# Altium schematic sheet PV_Shutdown.SchDoc
size A
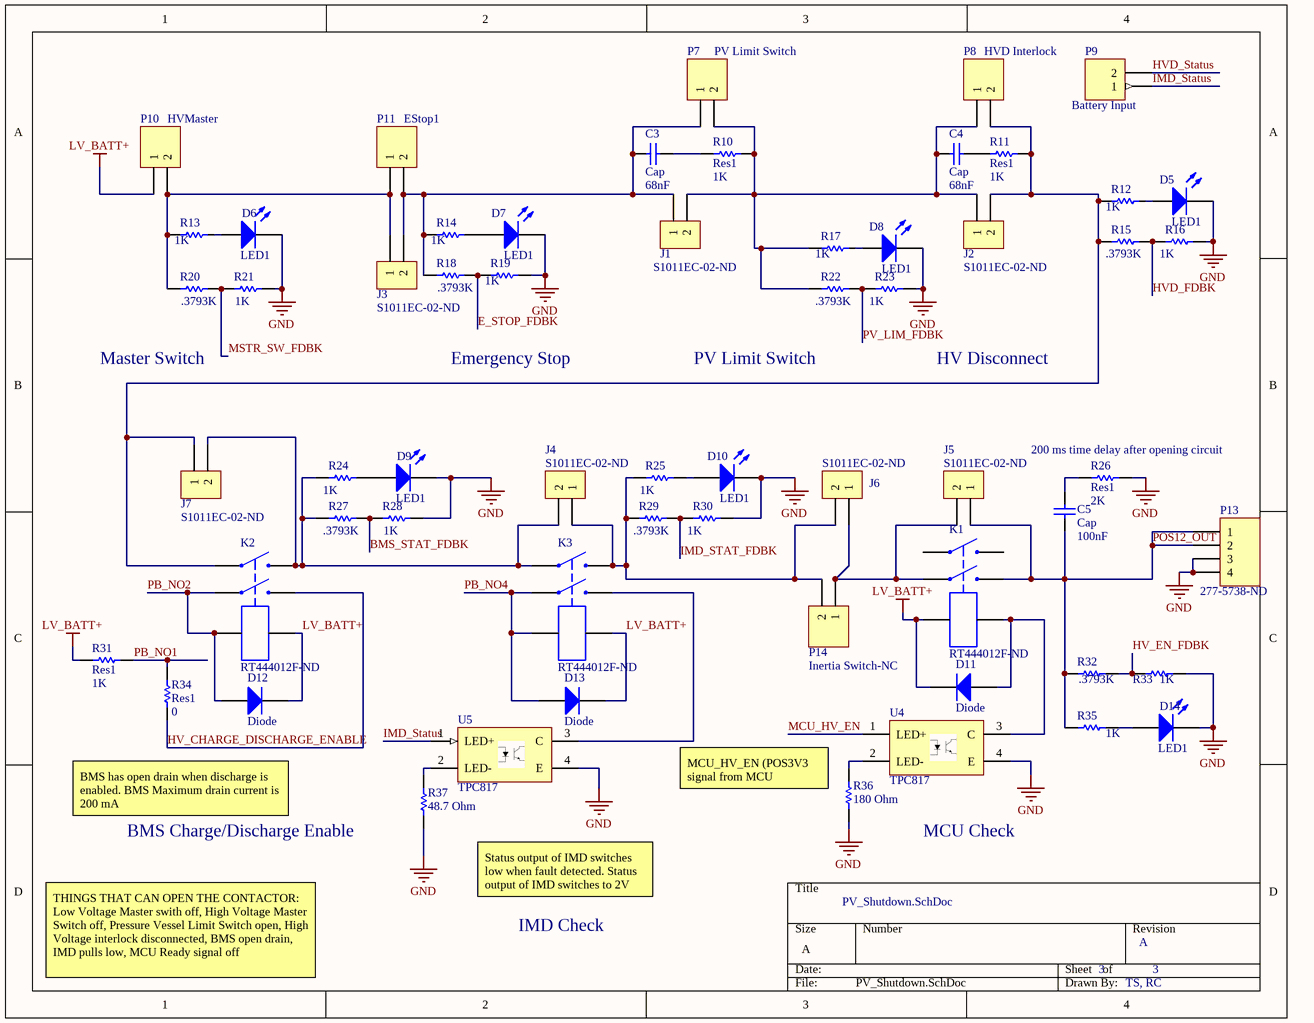
[diagram p0: PV_Shutdown.SchDoc]

## Parts
C3  Cap  value 68nF  [1206]
C4  Cap  value 68nF  [1206]
C5  Cap  value 100nF  [1206]
D5  LED1  [1206 LED]
D6  LED1  [1206 LED]
D7  LED1  [1206 LED]
D8  LED1  [1206 LED]
D9  LED1  [1206 LED]
D10  LED1  [1206 LED]
D11  Diode  [1N4007]
D12  Diode  [1N4007]
D13  Diode  [1N4007]
D14  LED1  [1206 LED]
J1  S1011EC-02-ND  [2 Pin Jumper]
J2  S1011EC-02-ND  [2 Pin Jumper]
J3  S1011EC-02-ND  [2 Pin Jumper]
J4  S1011EC-02-ND  [2 Pin Jumper]
J5  S1011EC-02-ND  [2 Pin Jumper]
J6  S1011EC-02-ND  [2 Pin Jumper]
J7  S1011EC-02-ND  [2 Pin Jumper]
K1  RT444012F-ND  [RT444012F]
K2  RT444012F-ND  [RT444012F]
K3  RT444012F-ND  [RT444012F]
P7  PV Limit Switch  [2POS TERM BLOCK]
P8  HVD Interlock  [2POS TERM BLOCK]
P9  Battery Input  [2POS TERM BLOCK]
P10  HVMaster  [2POS TERM BLOCK]
P11  EStop1  [2POS TERM BLOCK]
P13  277-5738-ND  [4POS TERM BLOCK]
P14  Inertia Switch-NC  [2POS TERM BLOCK]
R10  Res1  value 1K  [1206]
R11  Res1  value 1K  [1206]
R12  value 1K  [1206]  (hidden comment: Res1)
R13  value 1K  [1206]  (hidden comment: Res1)
R14  value 1K  [1206]  (hidden comment: Res1)
R15  value .3793K  [1206]  (hidden comment: Res1)
R16  value 1K  [1206]  (hidden comment: Res1)
R17  value 1K  [1206]  (hidden comment: Res1)
R18  value .3793K  [1206]  (hidden comment: Res1)
R19  value 1K  [1206]  (hidden comment: Res1)
R20  value .3793K  [1206]  (hidden comment: Res1)
R21  value 1K  [1206]  (hidden comment: Res1)
R22  value .3793K  [1206]  (hidden comment: Res1)
R23  value 1K  [1206]  (hidden comment: Res1)
R24  value 1K  [1206]  (hidden comment: Res1)
R25  value 1K  [1206]  (hidden comment: Res1)
R26  Res1  value 2K  [1206]
R27  value .3793K  [1206]  (hidden comment: Res1)
R28  value 1K  [1206]  (hidden comment: Res1)
R29  value .3793K  [1206]  (hidden comment: Res1)
R30  value 1K  [1206]  (hidden comment: Res1)
R31  Res1  value 1K  [1206]
R32  value .3793K  [1206]  (hidden comment: Res1)
R33  value 1K  [1206]  (hidden comment: Res1)
R34  Res1  value 0  [1206]
R35  value 1K  [1206]  (hidden comment: Res1)
R36  value 180 Ohm  [1206]  (hidden comment: Res1)
R37  value 48.7 Ohm  [1206]  (hidden comment: Res1)
U4  TPC817  [4-SOP]
U5  TPC817  [4-SOP]

## Nets
GND: D5.2(K) D6.2(K) D7.2(K) D8.2(K) D9.2(K) D10.2(K) D14.2(K) P13.3 P13.4 R16.1 R19.1 R21.1 R23.1 R26.2 R28.1 R30.1 R33.1 R36.2 R37.2 U4.4(E) U5.4(E)
LV_BATT+: D11.2(K) D12.2(K) D13.2(K) K1.1 K2.2 K3.2 P10.1 R31.1
BMS_STAT_FDBK: R27.1 R28.2
E_STOP_FDBK: R18.1 R19.2
HV_CHARGE_DISCHARGE_ENABLE: K2.4 R34.1
HV_EN_FDBK: R32.1 R33.2
HVD_FDBK: R15.1 R16.2
HVD_Status: P9.2
IMD_STAT_FDBK: R29.1 R30.2
IMD_Status: P9.1 U5.1(LED+)
MCU_HV_EN: U4.1(LED+)
MSTR_SW_FDBK: R20.1 R21.2
PB_NO1: R31.2 R34.2
PB_NO2: D12.1(A) K2.1 K2.3
PB_NO4: D13.1(A) K3.1 K3.3
POS12_OUT: C5.1 J5.1 K1.4 P13.1 P13.2 R32.2 R35.2
PV_LIM_FDBK: R22.1 R23.2
NetC3_1: C3.1 J1.1 J3.2 P7.1 P11.2 R14.1 R18.2
NetC3_2: C3.2 R10.1
NetC4_1: C4.1 J1.2 J2.1 P7.2 P8.1 R10.2 R17.1 R22.2
NetC4_2: C4.2 R11.1
NetC5_2: C5.2 R26.1
NetD5_1: D5.1(A) R12.2
NetD6_1: D6.1(A) R13.2
NetD7_1: D7.1(A) R14.2
NetD8_1: D8.1(A) R17.2
NetD9_1: D9.1(A) R24.2
NetD10_1: D10.1(A) R25.2
NetD11_1: D11.1(A) K1.2 U4.3(C)
NetD14_1: D14.1(A) R35.1
NetJ2_2: J2.2 J7.1 K2.5 P8.2 R11.2 R12.1 R15.2
NetJ3_1: J3.1 P10.2 P11.1 R13.1 R20.2
NetJ4_1: J4.1 J6.2 K3.6 P14.2 R25.1 R29.2
NetJ4_2: J4.2 J7.2 K2.6 K3.5 R24.1 R27.2
NetJ5_2: J5.2 J6.1 K1.3 P14.1
NetK3_4: K3.4 U5.3(C)
NetR36_1: R36.1 U4.2(LED-)
NetR37_1: R37.1 U5.2(LED-)

Not connected (* = marked no-connect by the designer): K1 5 6

## Notes on the sheet
- Master Switch
- Emergency Stop
- PV Limit Switch
- HV Disconnect
- (near R26) 200 ms time delay after opening circuit
- BMS has open drain when discharge is enabled. BMS Maximum drain current is 200 mA
- (near R37) BMS Charge/Discharge Enable
- (near R36) MCU_HV_EN (POS3V3 signal from MCU
- MCU Check
- Status output of IMD switches low when fault detected. Status output of IMD switches to 2V when no fault is present
- PV_Shutdown.SchDoc
- THINGS THAT CAN OPEN THE CONTACTOR: Low Voltage Master swith off, High Voltage Master Switch off, Pressure Vessel Limit Switch open, High Voltage interlock disconnected, BMS open drain, IMD pulls low, MCU Ready signal off
- IMD Check
- 3
- A
- TS, RC

## Library data of the parts
C3-C5 = Cap: Capacitor; Published: 8-Jun-2000; LatestRevisionDate: 17-Jul-2002; LatestRevisionNote: Re-released for DXP Platform.; PackageReference: RAD-0.3; Publisher: Altium Limited; PackageDescription: Radial Cap, Thru-Hole; 2 Leads; 0.3 in Pin Spacing
D5-D10 D14 = LED1: Typical RED GaAs LED; Published: 8-Jun-2000; LatestRevisionDate: 08-Jul-2005; LatestRevisionNote: Mech Layer 1 removed.; PackageReference: LED-1; Publisher: Altium Limited; PackageDescription: LED; 2 Leads
D11-D13 = Diode: Default Diode; Published: 8-Jun-2000; LatestRevisionDate: 17-Jul-2002; LatestRevisionNote: Re-released for DXP Platform.; PackageVersion: Sep-1996; PackageReference: SMC; Publisher: Altium Limited; PackageDescription: DO-214-AB/SMC; 2 C-Bend Leads; Body 7.9 x 5.9 mm, inc. leads (LxW); Code_JEDEC: DO-214-AB
J1-J7 = S1011EC-02-ND: CONN HEADER .100" SNGL STR 2POS; ComponentLink1Description: Male- Digikey; ComponentLink1URL: https://www.digikey.com/product-detail/en/sullins-connector-solutions/PRPC002SAAN-RC/S1011EC-02-ND/2775252; ComponentLink2Description: Female - Digikey; ComponentLink2URL: https://www.digikey.com/products/en?keywords=S9001-ND
K1-K3 = RT444012F-ND: RELAY GEN PURPOSE DPST 8A 12V; ComponentLink1Description: Digikey; ComponentLink1URL: https://www.digikey.com/product-detail/en/te-connectivity-potter-brumfield-relays/RT444012F/RT444012F-ND/1427665
P7 P8 P10 P11 P14 = Header 2: 277-5733-ND; LatestRevisionDate: 17-Jul-2002; LatestRevisionNote: Re-released for DXP Platform.; Publisher: Altium Limited
  P14: ComponentLink1Description: Electric Motor Sport; ComponentLink1URL: http://www.electricmotorsport.com/resettable-inertia-switch-crash-sensor-kit.html
P9 = Header 2: Header, 2-Pin; LatestRevisionDate: 17-Jul-2002; LatestRevisionNote: Re-released for DXP Platform.; Publisher: Altium Limited
P13 = Header 4: Header, 4-Pin; LatestRevisionDate: 17-Jul-2002; LatestRevisionNote: Re-released for DXP Platform.; Publisher: Altium Limited
R10-R37 = Res1: Resistor; Published: 8-Jun-2000; LatestRevisionDate: 17-Jul-2002; LatestRevisionNote: Re-released for DXP Platform.; PackageReference: AXIAL-0.3; Publisher: Altium Limited; PackageDescription: Axial Device, Thru-Hole; 2 Leads; 0.3 in Pin Spacing
U4 U5 = TPC817: Opto-Coupler; ComponentLink1Description: Digi-Key; ComponentLink1URL: https://www.digikey.com/product-detail/en/taiwan-semiconductor-corporation/TPC817S1D-RAG/TPC817S1D-RAGCT-ND/7359685; ComponentLink2Description: Datasheet; ComponentLink2URL: http://www.taiwansemi.com/products/datasheet/TPC817%20SERIES_C1612.pdf